# Altium schematic sheet AUDIO CODEC.SchDoc
size A4; SheetNumber: 2; SheetTotal: 11
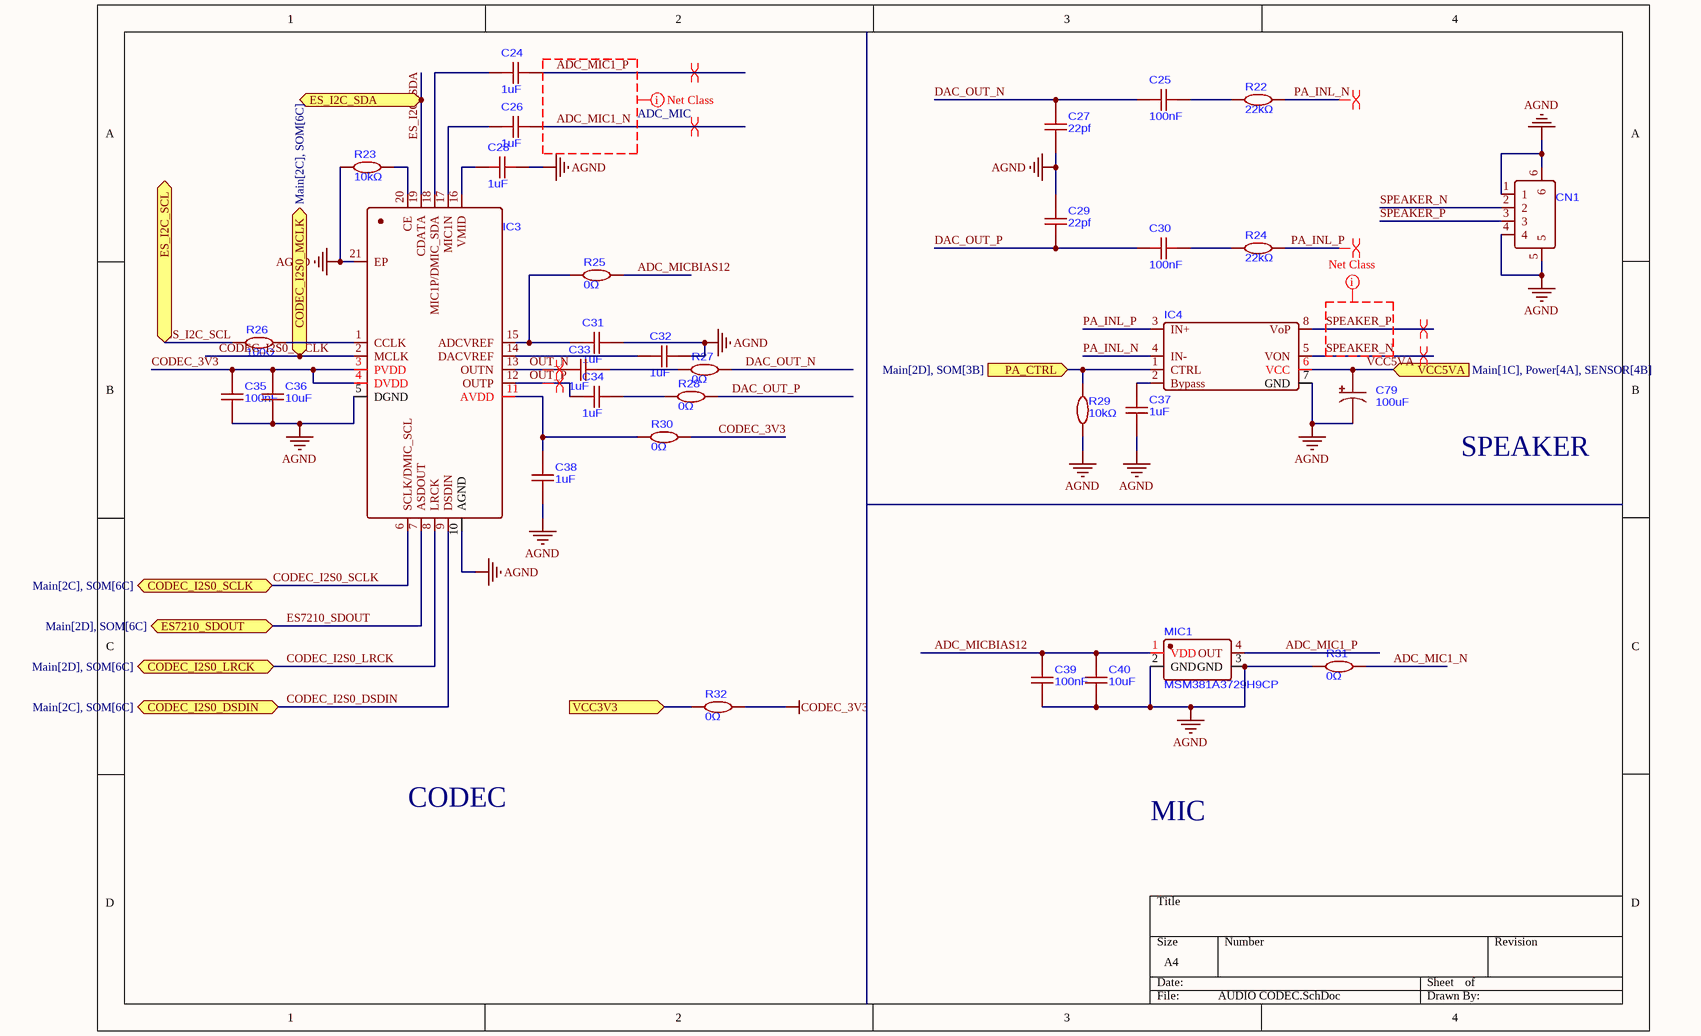
[diagram p0: AUDIO CODEC.SchDoc]

## Parts
C24  1uF  [C0603]
C25  100nF  [C0603]
C26  1uF  [C0603]
C27  22pf  [C0603]
C28  1uF  [C0603]
C29  22pf  [C0603]
C30  100nF  [C0603]
C31  1uF  [C0603]
C32  1uF  [C0603]
C33  1uF  [C0603]
C34  1uF  [C0603]
C35  100nF  [C0603]
C36  10uF  [C0603]
C37  1uF  [C0603]
C38  1uF  [C0603]
C39  100nF  [C0603]
C40  10uF  [C0603]
C79  100uF  [CAP-SMD_L3.5-W2.8-R-RD]
CN1  533980471  [CONN-SMD_4P-P1.25_XUNPU_WAFER-GH1.25-4PWB]  (value not drawn)
IC3  Low Power Mono Audio CODEC  [WQFN-20_L3.0-W3.0-P0.40-BL-EP1.7]  (value not drawn)
IC4  NS4150B 3.0W Mono Class-D Audio Power Amplifier  [MSOP-8_L3.0-W3.0-P0.65-LS5.0-BL]  (value not drawn)
MIC1  MSM381A3729H9CP  [MIC-SMD_4P-L3.8-W3.0-P2.46-S1.70-TR]
R22  22kΩ  [R0603]
R23  10kΩ  [R0603]
R24  22kΩ  [R0603]
R25  0Ω  [R0603]
R26  100Ω  [R0603]
R27  0Ω  [R0603]
R28  0Ω  [R0603]
R29  10kΩ  [R0603]
R30  0Ω  [R0603]
R31  0Ω  [R0603]
R32  0Ω  [R0603]

## Ports
CODEC_I2S0_DSDIN (bidir, see Main[2C], SOM[6C]), CODEC_I2S0_LRCK (bidir, see Main[2D], SOM[6C]), CODEC_I2S0_MCLK (bidir, see Main[2C], SOM[6C]), CODEC_I2S0_SCLK (bidir, see Main[2C], SOM[6C]), ES7210_SDOUT (bidir, see Main[2D], SOM[6C]), ES_I2C_SCL (bidir, see Main[2C], DSI&CSI CONNECTOR[2C], interfaceUART&I2C[2C], SOM[6C]), ES_I2C_SDA (bidir, see Main[2C], DSI&CSI CONNECTOR[2C], interfaceUART&I2C[2C], SOM[6C]), PA_CTRL (in, see Main[2D], SOM[3B]), VCC3V3 (in, see Main[1C], Power[4C], SENSOR[3A], SOM[4A], USB[4C]), VCC5VA (in, see Main[1C], Power[4A], SENSOR[4B])

## Nets
AGND: C27.1 C28.1 C29.2 C31.1 C32.1 C35.1 C36.1 C37.1 C38.2 C39.1 C40.1 C79.2 CN1.1 CN1.4 CN1.5 CN1.6 IC3.5(DGND) IC3.10(AGND) IC3.21(EP) IC4.7(GND) MIC1.2(GND) MIC1.3(GND) R23.1 R29.1 R31.1
CODEC_3V3: C35.2 C36.2 IC3.3(PVDD) IC3.4(DVDD) R30.2 R32.2
ADC_MIC1_N: C26.1 R31.2
ADC_MIC1_P: C24.2 MIC1.4(OUT)
ADC_MICBIAS12: C39.2 C40.2 MIC1.1(VDD) R25.2
CODEC_I2S0_DSDIN: IC3.9(DSDIN) ; port CODEC_I2S0_DSDIN
CODEC_I2S0_LRCK: IC3.8(LRCK) ; port CODEC_I2S0_LRCK
CODEC_I2S0_MCLK: IC3.2(MCLK) ; port CODEC_I2S0_MCLK
CODEC_I2S0_SCLK: IC3.6(SCLK/DMIC_SCL) ; port CODEC_I2S0_SCLK
DAC_OUT_N: C25.1 C27.2 R27.2
DAC_OUT_P: C29.1 C30.1 R28.2
ES7210_SDOUT: IC3.7(ASDOUT) ; port ES7210_SDOUT
ES_I2C_SCL: R26.1 ; port ES_I2C_SCL
ES_I2C_SDA: IC3.19(CDATA) ; port ES_I2C_SDA
OUT_N: C33.2 IC3.13(OUTN)
OUT_P: C34.2 IC3.12(OUTP)
PA_CTRL: IC4.1(CTRL) R29.2 ; port PA_CTRL
PA_INL_N: IC4.4(IN-) R22.2
PA_INL_P: IC4.3(IN+) R24.2
SPEAKER_N: CN1.2 IC4.5(VON)
SPEAKER_P: CN1.3 IC4.8(VoP)
VCC3V3: R32.1 ; port VCC3V3
VCC5VA: C79.1 IC4.6(VCC) ; port VCC5VA
NetC24_1: C24.1 IC3.18(MIC1P/DMIC_SDA)
NetC25_2: C25.2 R22.1
NetC26_2: C26.2 IC3.17(MIC1N)
NetC28_2: C28.2 IC3.16(VMID)
NetC30_2: C30.2 R24.1
NetC31_2: C31.2 IC3.15(ADCVREF) R25.1
NetC32_2: C32.2 IC3.14(DACVREF)
NetC33_1: C33.1 R27.1
NetC34_1: C34.1 R28.1
NetC37_2: C37.2 IC4.2(Bypass)
NetC38_1: C38.1 IC3.11(AVDD) R30.1
NetIC3_1: IC3.1(CCLK) R26.2
NetIC3_20: IC3.20(CE) R23.2

## Layout directives
net class ADC_MIC: ADC_MIC1_N, ADC_MIC1_P
differential pair; net class DIFF; differential pair class DIFF: ADC_MIC1_N, ADC_MIC1_P, OUT_N, OUT_P, PA_INL_N, PA_INL_P, SPEAKER_N, SPEAKER_P
net class SPEAKER: SPEAKER_N, SPEAKER_P

## Notes on the sheet
- SPEAKER
- CODEC
- MIC

## Library data of the parts
C24 C26 C28 C31-C34 C37 C38 = CL10B105KA8NNNC: 25V 1uF X7R ±10% 0603 Ceramic Capacitors ROHS
C25 C30 C35 C39 = CC0603KRX7R9BB104: 50V 100nF X7R ±10% 0603 Ceramic Capacitors ROHS
C27 C29 = CL10C220JB8NNNC: 50V 22pF C0G ±5% 0603 Ceramic Capacitors RoHS
C36 C40 = CL10A106MA8NRNC: 25V 10uF X5R ±20% 0603 Ceramic Capacitors ROHS
C79 = CA45A-B-10V-100UF-K: 100uF 10V ±10% CASE-B-3528-19(mm) Tantalum Capacitors RoHS
CN1 = 533980471: 4P PicoBlade(MX 1.25) 1x4P Tin -40℃~+105℃ White 1.25mm 125V 4 1A 1 Surface Mount,Vertical SMD,P=1.25mm Headers, Male Pins RoHS
IC3 = ES8311: 1.8V~3.3V QFN-20-EP(3x3) Signal Switches, Multiplexers, Decoders RoHS
IC4 = NS4150: 4mA 1-Channel 3Wx1@4Ω Class D MSOP-8 Audio Amplifiers RoHS
MIC1 = MSM381A3729H9CP: OCLGA-4(3x3.8) MEMS Microphones ROHS
R22 R24 = RC0603FR-0722KL: 100mW 22kΩ 75V ±100ppm/℃ Thick Film Resistor ±1% 0603 Chip Resistor - Surface Mount RoHS
R23 R29 = RC0603FR-0710KL: 100mW 10kΩ 75V ±100ppm/℃ Thick Film Resistor ±1% 0603 Chip Resistor - Surface Mount ROHS
R25 R27 R28 R30-R32 = RC0603JR-070RL: 100mW 0Ω 75V Thick Film Resistor ±5% 0603 Chip Resistor - Surface Mount RoHS
R26 = RC0603FR-07100RL: 100mW 100Ω 75V ±100ppm/℃ Thick Film Resistor ±1% 0603 Chip Resistor - Surface Mount ROHS